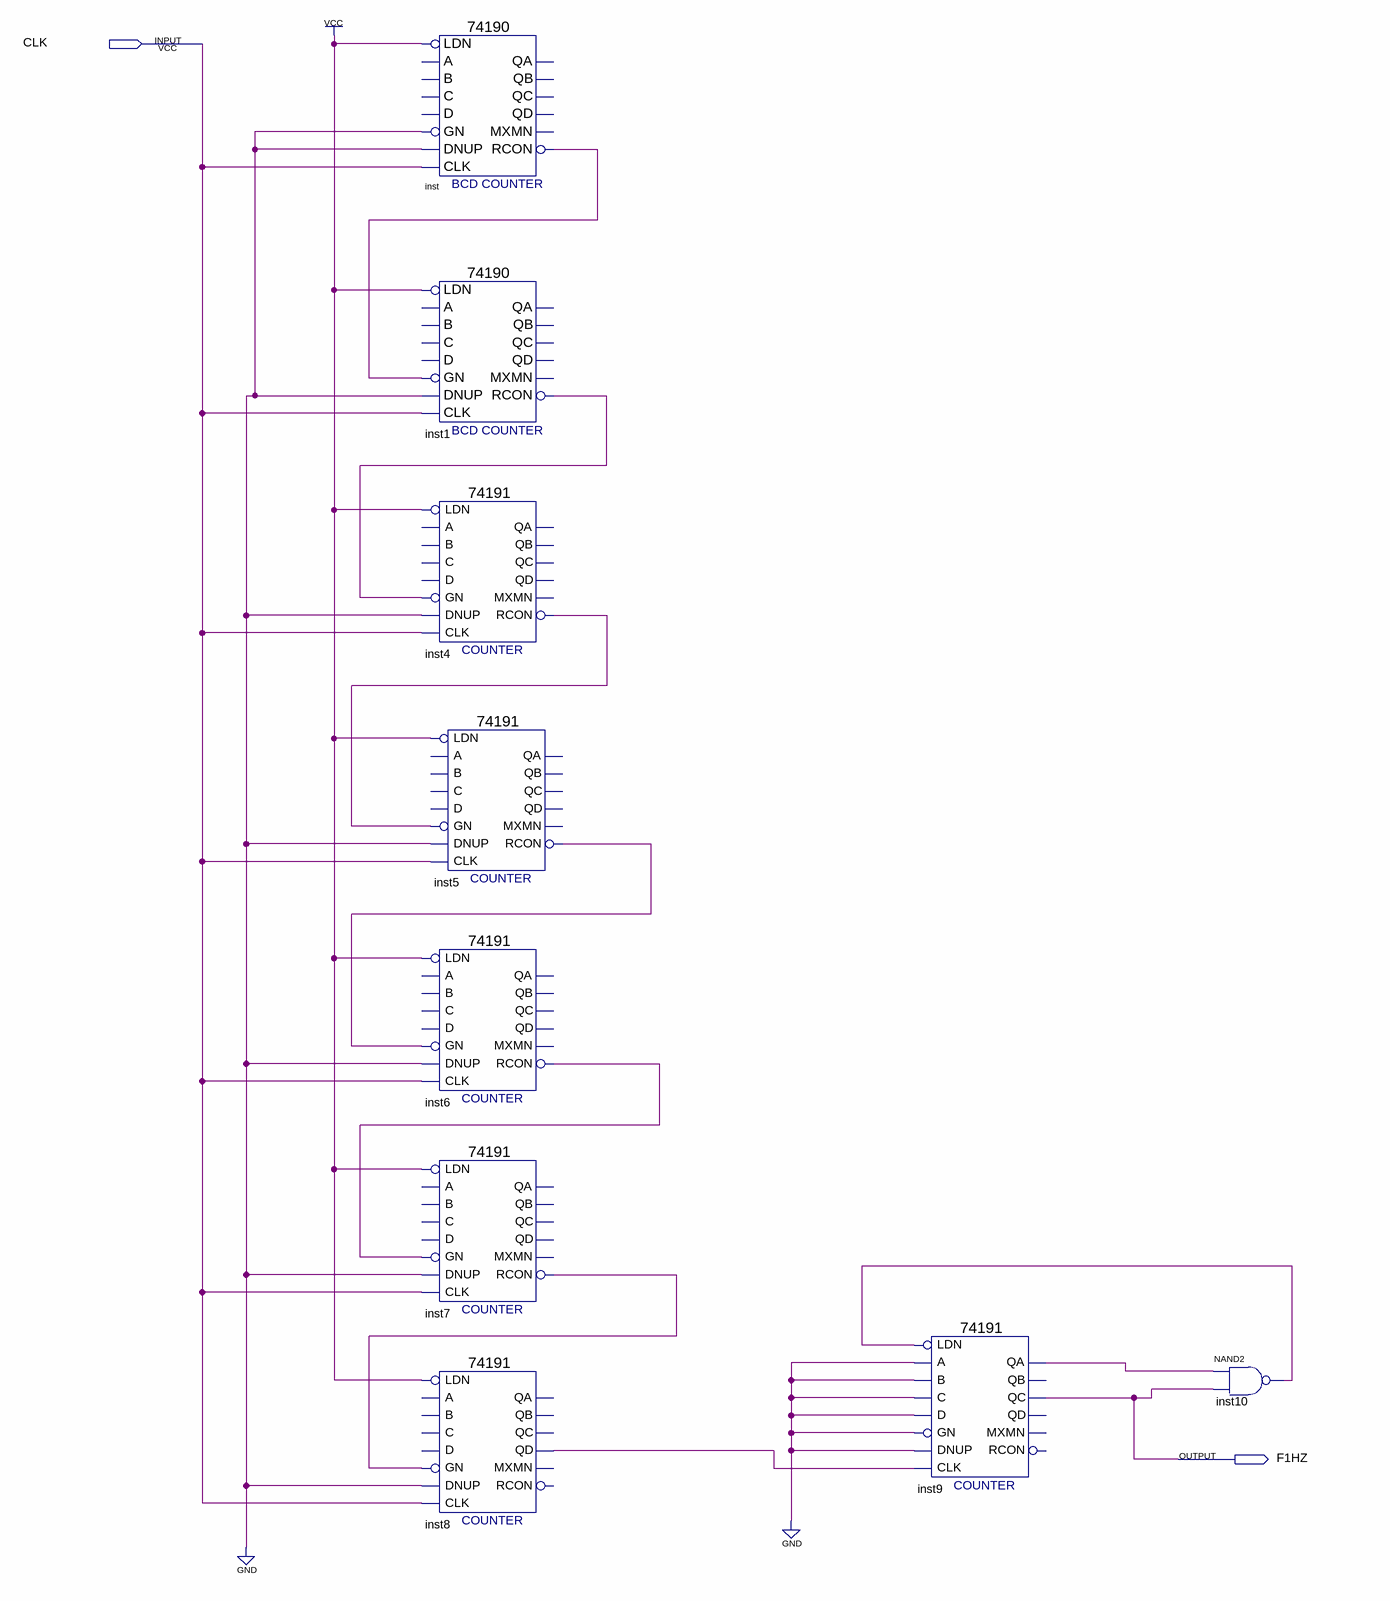
[diagram p0: schematic sheet]
// Quartus schematic con100.bdf as structural Verilog: 9 symbols, 2 pins
module con100 (
  input  CLK,
  output F1HZ
);

  wire inst1_rcon, inst4_rcon, inst5_rcon, inst6_rcon, inst7_rcon, inst8_qd, inst9_qa, inst10_out, inst_rcon;

  \74190  inst (
    .LDN(1'b1), .GN(1'b0), .CLK(CLK), .DNUP(1'b0), .RCON(inst_rcon));  // open: A, C, B, D, QA, QB, QD, QC, MXMN
  \74190  inst1 (
    .LDN(1'b1), .GN(inst_rcon), .CLK(CLK), .DNUP(1'b0), .RCON(inst1_rcon));  // open: A, C, B, D, QA, QB, QD, QC, MXMN
  \74191  inst4 (
    .LDN(1'b1), .CLK(CLK), .DNUP(1'b0), .GN(inst1_rcon), .RCON(inst4_rcon));  // open: D, C, B, A, MXMN, QA, QB, QD, QC
  \74191  inst5 (
    .LDN(1'b1), .CLK(CLK), .DNUP(1'b0), .GN(inst4_rcon), .RCON(inst5_rcon));  // open: D, C, B, A, MXMN, QA, QB, QD, QC
  \74191  inst6 (
    .LDN(1'b1), .CLK(CLK), .DNUP(1'b0), .GN(inst5_rcon), .RCON(inst6_rcon));  // open: D, C, B, A, MXMN, QA, QB, QD, QC
  \74191  inst7 (
    .LDN(1'b1), .CLK(CLK), .DNUP(1'b0), .GN(inst6_rcon), .RCON(inst7_rcon));  // open: D, C, B, A, MXMN, QA, QB, QD, QC
  \74191  inst8 (
    .LDN(1'b1), .CLK(CLK), .DNUP(1'b0), .GN(inst7_rcon), .QD(inst8_qd));  // open: D, C, B, A, RCON, MXMN, QA, QB, QC
  \74191  inst9 (
    .LDN(inst10_out), .D(1'b0), .C(1'b0), .B(1'b0), .A(1'b0), .CLK(inst8_qd), .DNUP(1'b0), .GN(1'b0),
    .QA(inst9_qa), .QC(F1HZ));  // open: RCON, MXMN, QB, QD
  nand inst10 (inst10_out, inst9_qa, F1HZ);
endmodule
